# Altium schematic sheet 3V3_LDO.SchDoc
size A; SheetNumber: 6; SheetTotal: 6
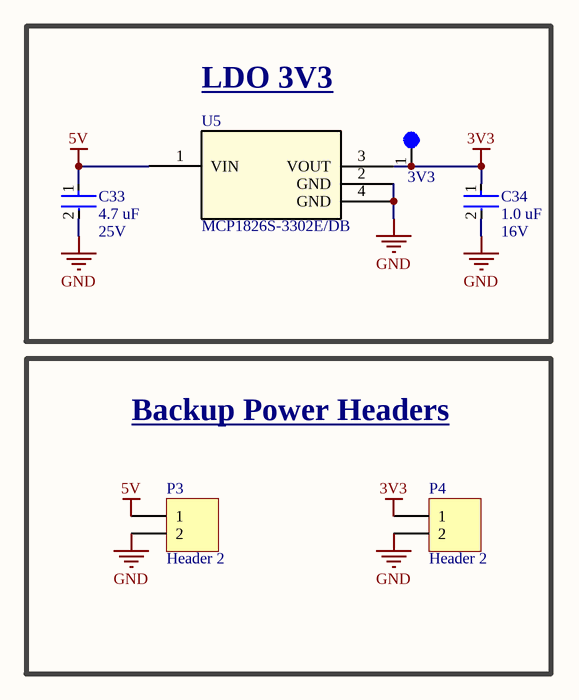
[diagram p0: 3V3_LDO.SchDoc]

## Parts
3V3  5003  [TEST-POINT-0001]  (value not drawn)
C33  Capacitance: 4.7 uF  Voltage: 25V  [CAP-0603]  (hidden comment: CC0603KRX5R8BB475)
C34  Capacitance: 1.0 uF  Voltage: 16V  [CAP-0603]  (hidden comment: CC0603KRX7R7BB105)
P3  Header 2  [HDR1X2]
P4  Header 2  [HDR1X2]
U5  MCP1826S-3302E/DB  [SOT-223_3MC_MCH]

## Blocks framed on the sheet
LDO 3V3: 3V3 C33 C34 U5
Backup Power Headers: P3 P4

## Nets
3V3: 3V3.1 C34.1 P4.1 U5.3(VOUT)
5V: C33.1 P3.1 U5.1(VIN)
GND: C33.2 C34.2 P3.2 P4.2 U5.2(GND) U5.4(GND)

## Library data of the parts
3V3 = TEST-POINT-0001: Oranange PC Test Point, Miniature Phoisphor Bronze Silver Plating Through Hole Mounting Type
C33 = CAP-4.7U-0001: CAP CER 4.7UF 25V X5R 0603; Device Class: Ceramic; Size: 0603
C34 = CAP-1U-0002: CAP CER 1UF 16V X7R 0603; Device Class: Ceramic; Size: 0603
P3 P4 = Header 2: Header, 2-Pin; LatestRevisionDate: 17-Jul-2002; LatestRevisionNote: Re-released for DXP Platform.; Publisher: Altium Limited
U5 = IC-LDO-0003: Linear Voltage Regulator IC Positive Fixed 1 Output 1A SOT-223-3; Manufacturer_Name: Microchip; Copyright: Copyright (C) 2025 Ultra Librarian. All rights reserved.; Manufacturer_Part_Number: MCP1826S-3302E/DB; RefDes: RefDes; Type: Type; ComponentLink1Description: Datasheet; ComponentLink1URL: https://ww1.microchip.com/downloads/en/DeviceDoc/22057B.pdf